# EAGLE schematic badge24_v1.1 (EAGLE 9.6.2)
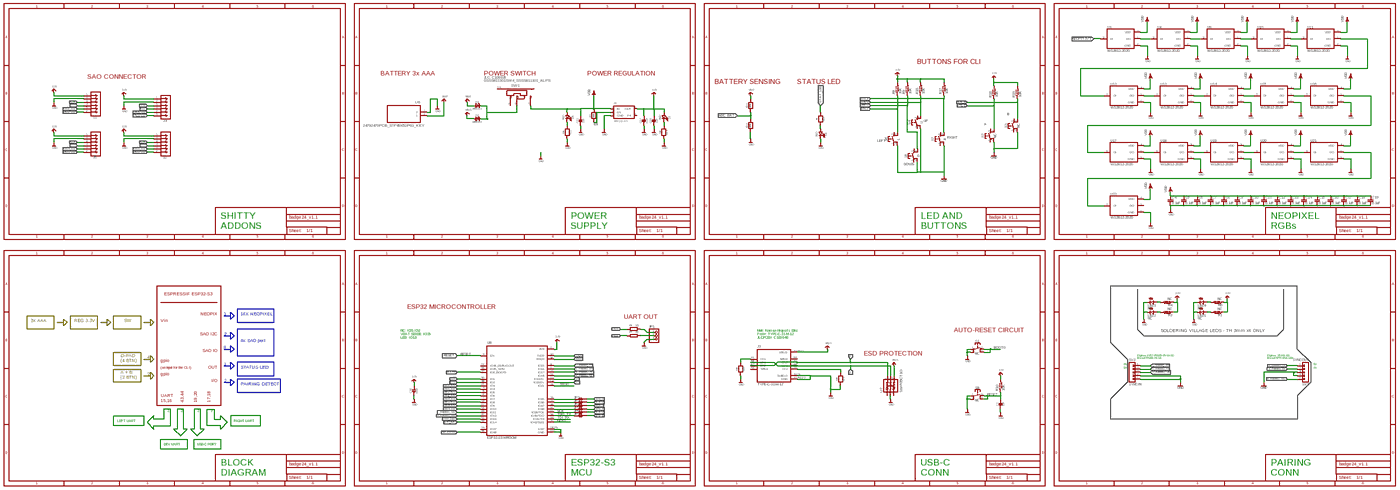
[diagram p0: schematic, sheet 1, overview]
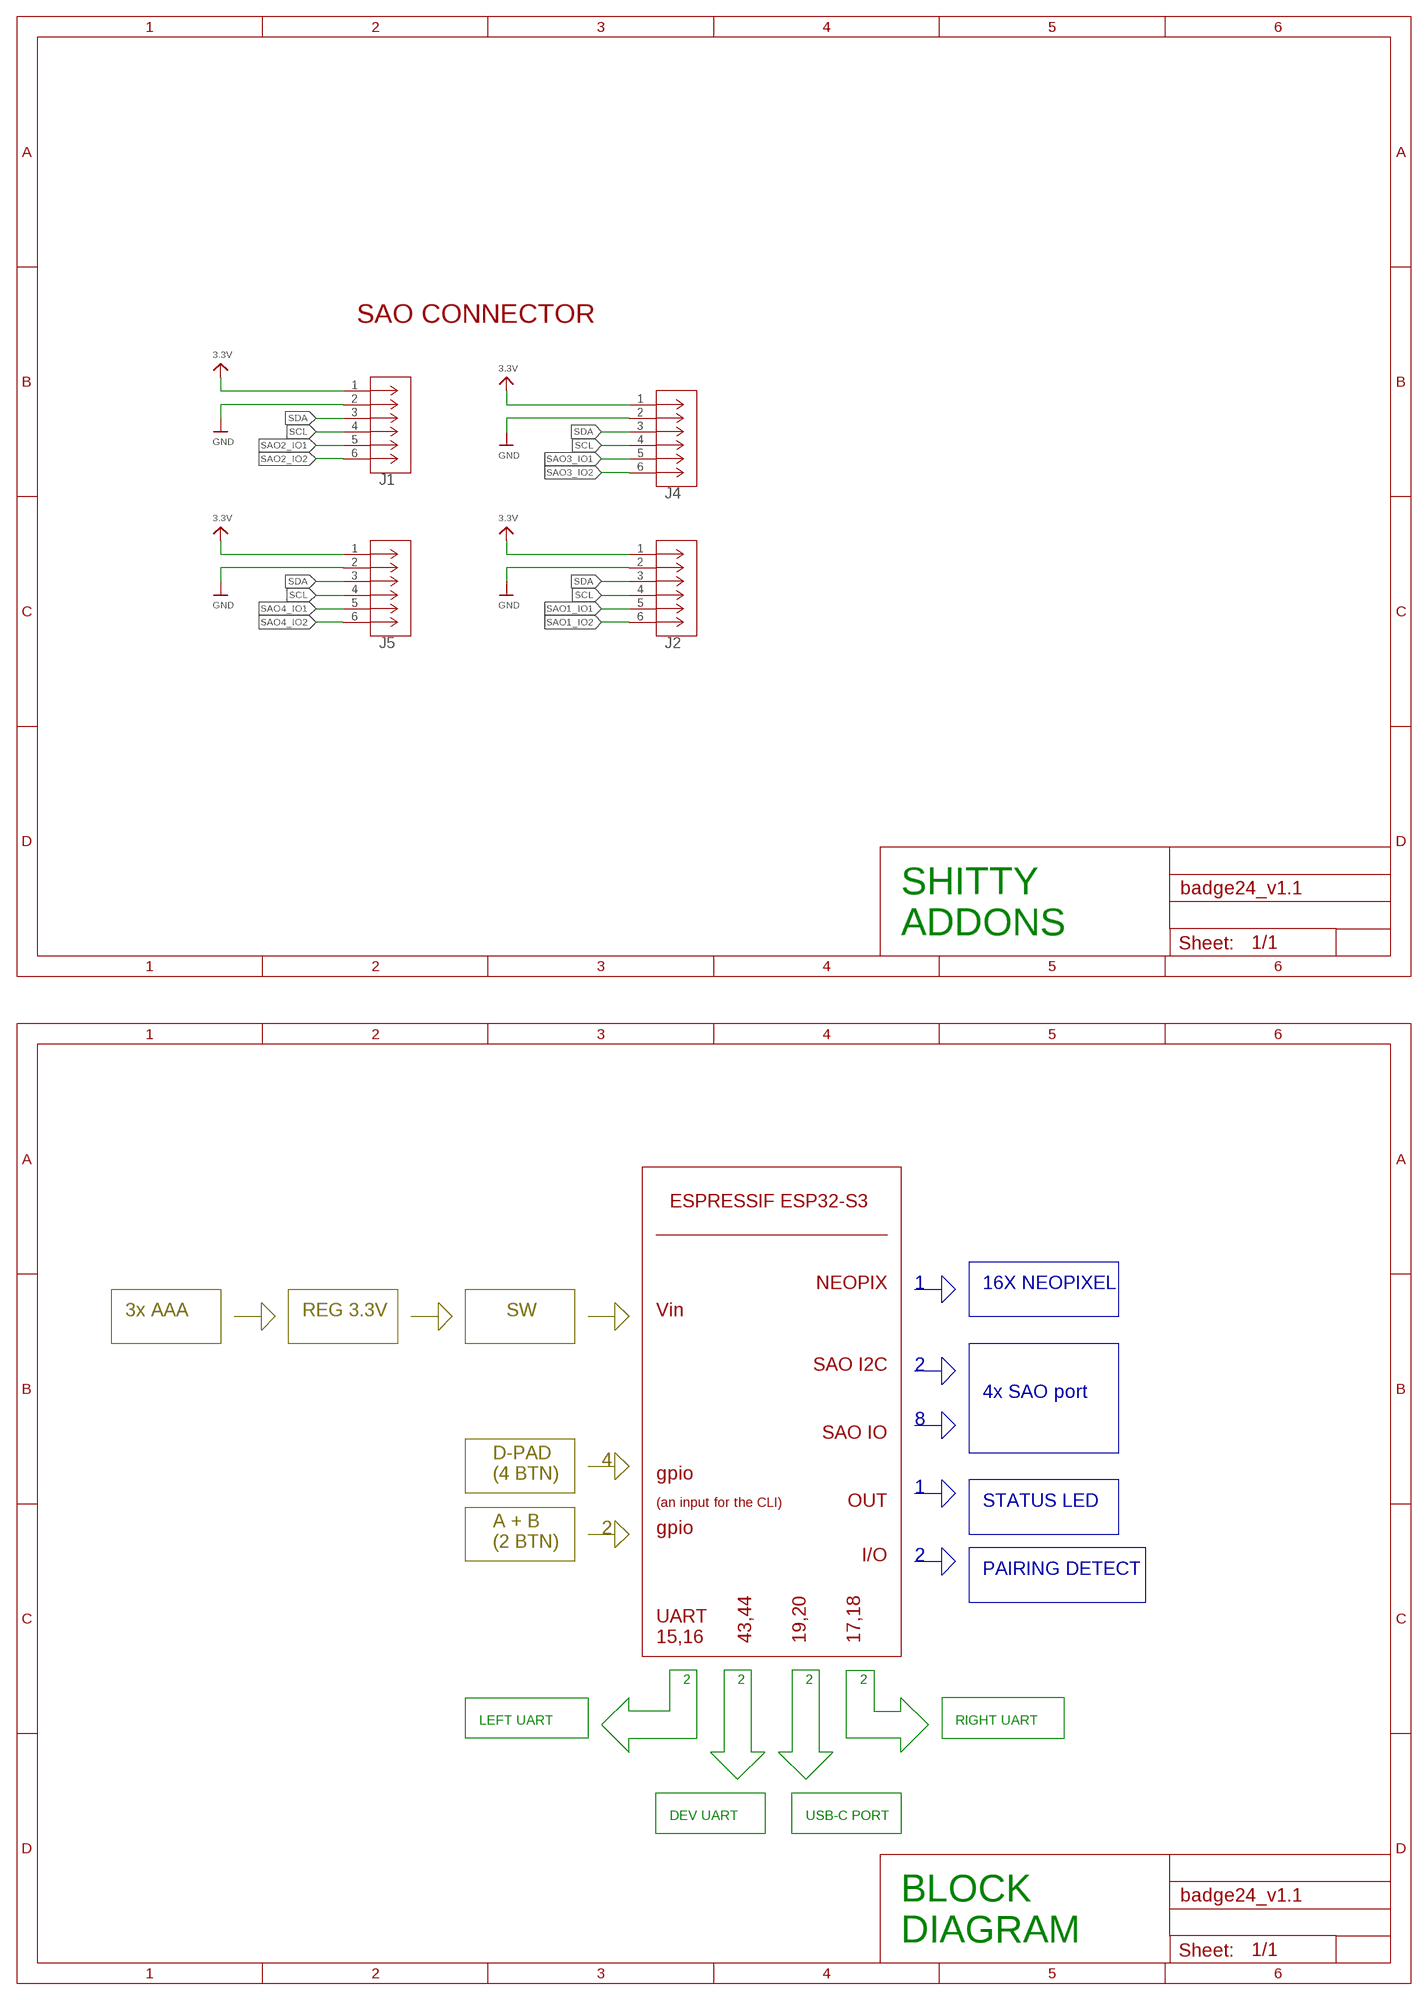
[diagram p1: schematic, sheet 1, part 1 of 4]
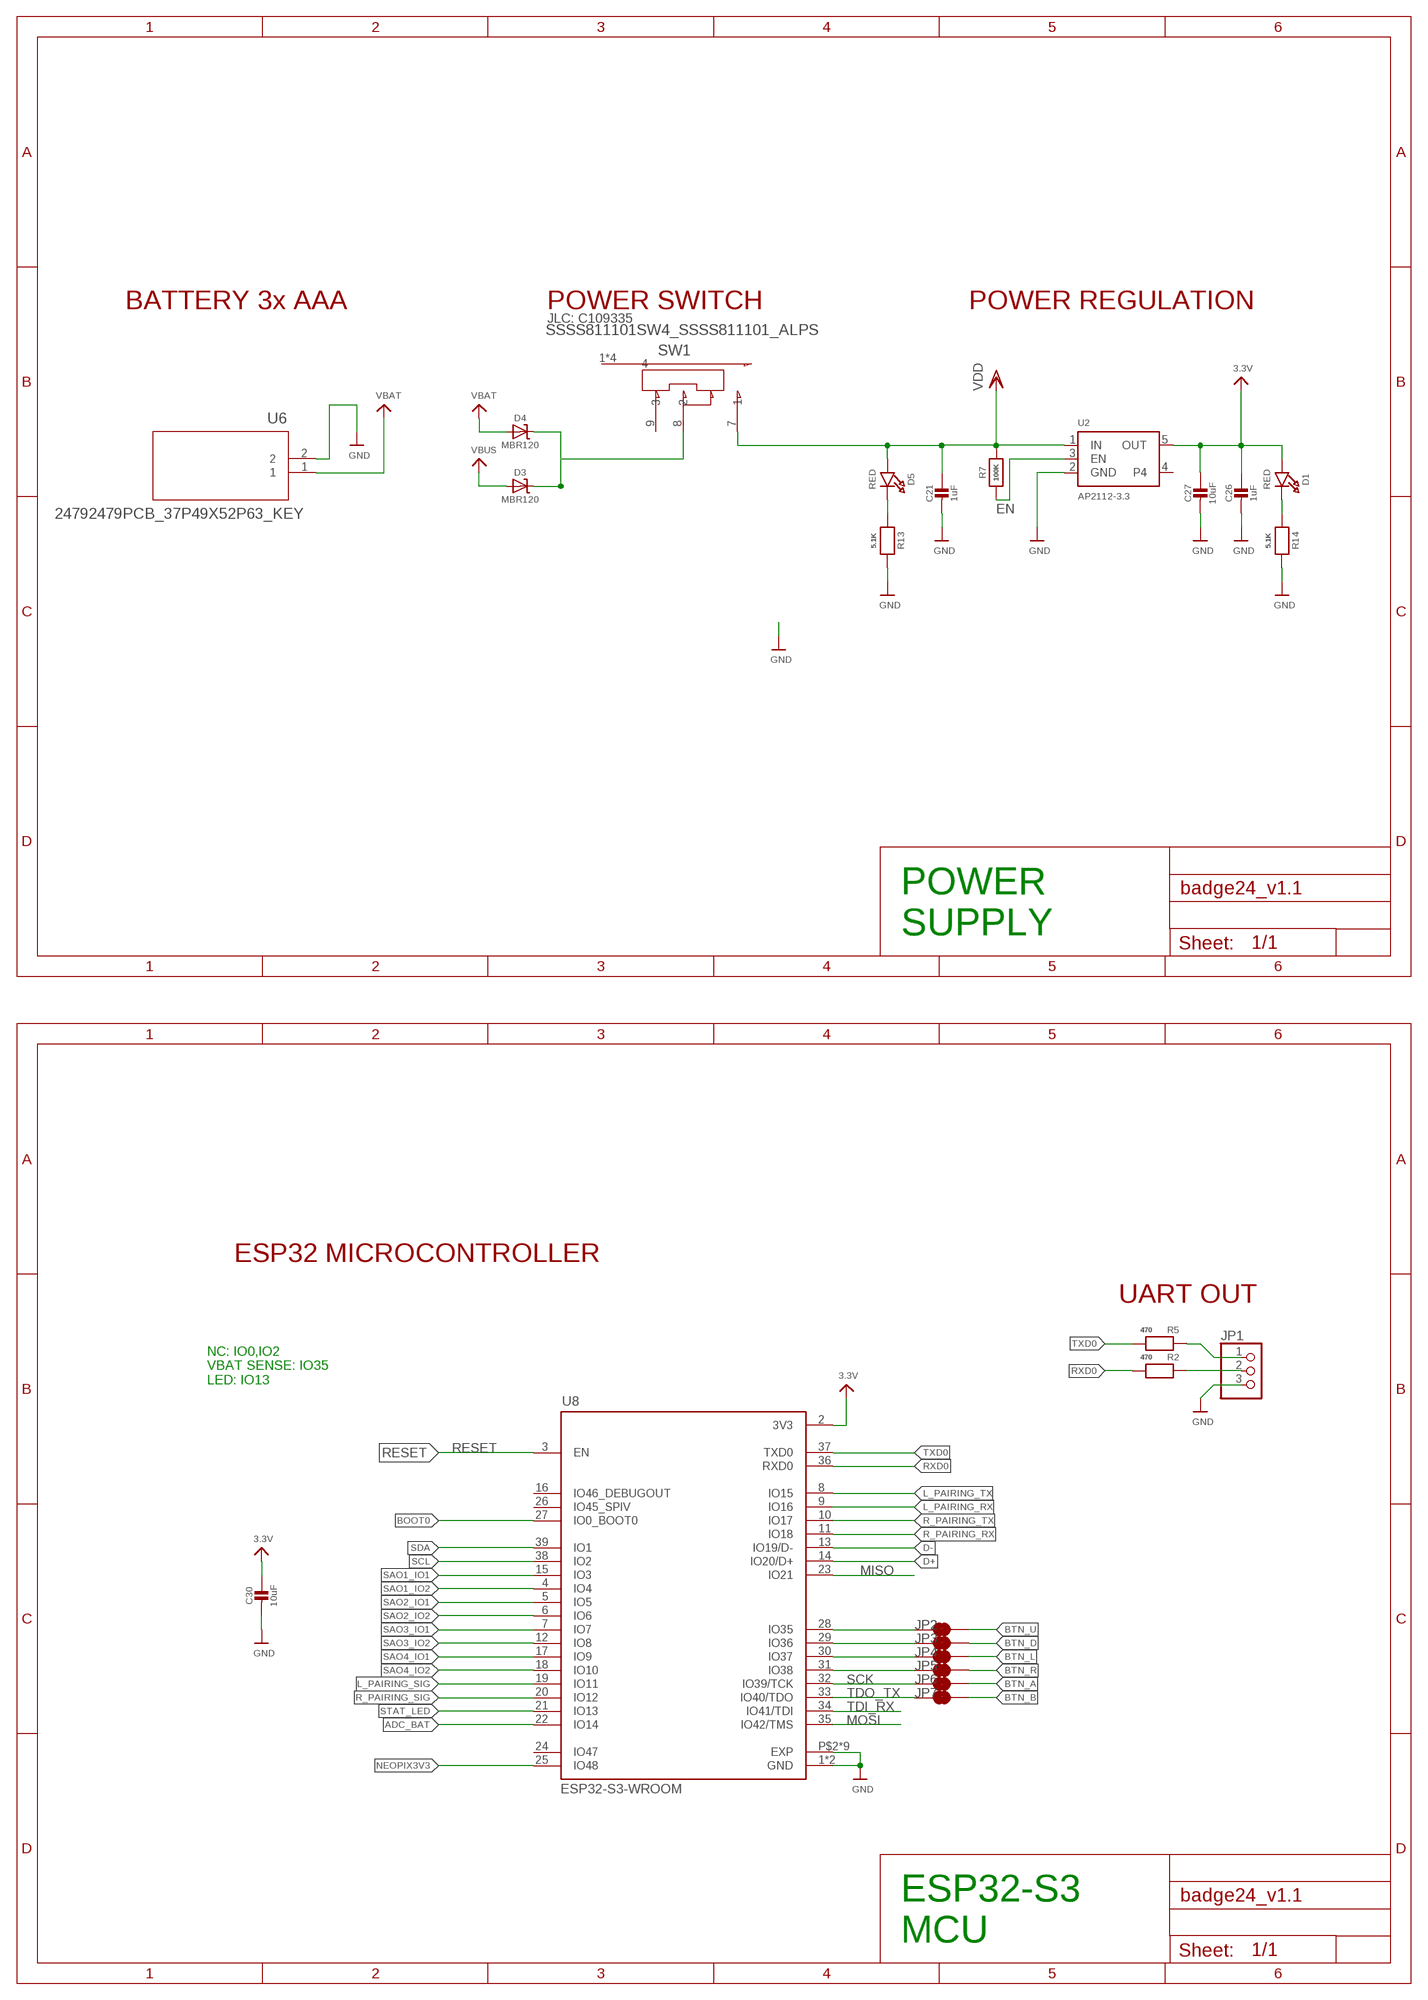
[diagram p2: schematic, sheet 1, part 2 of 4]
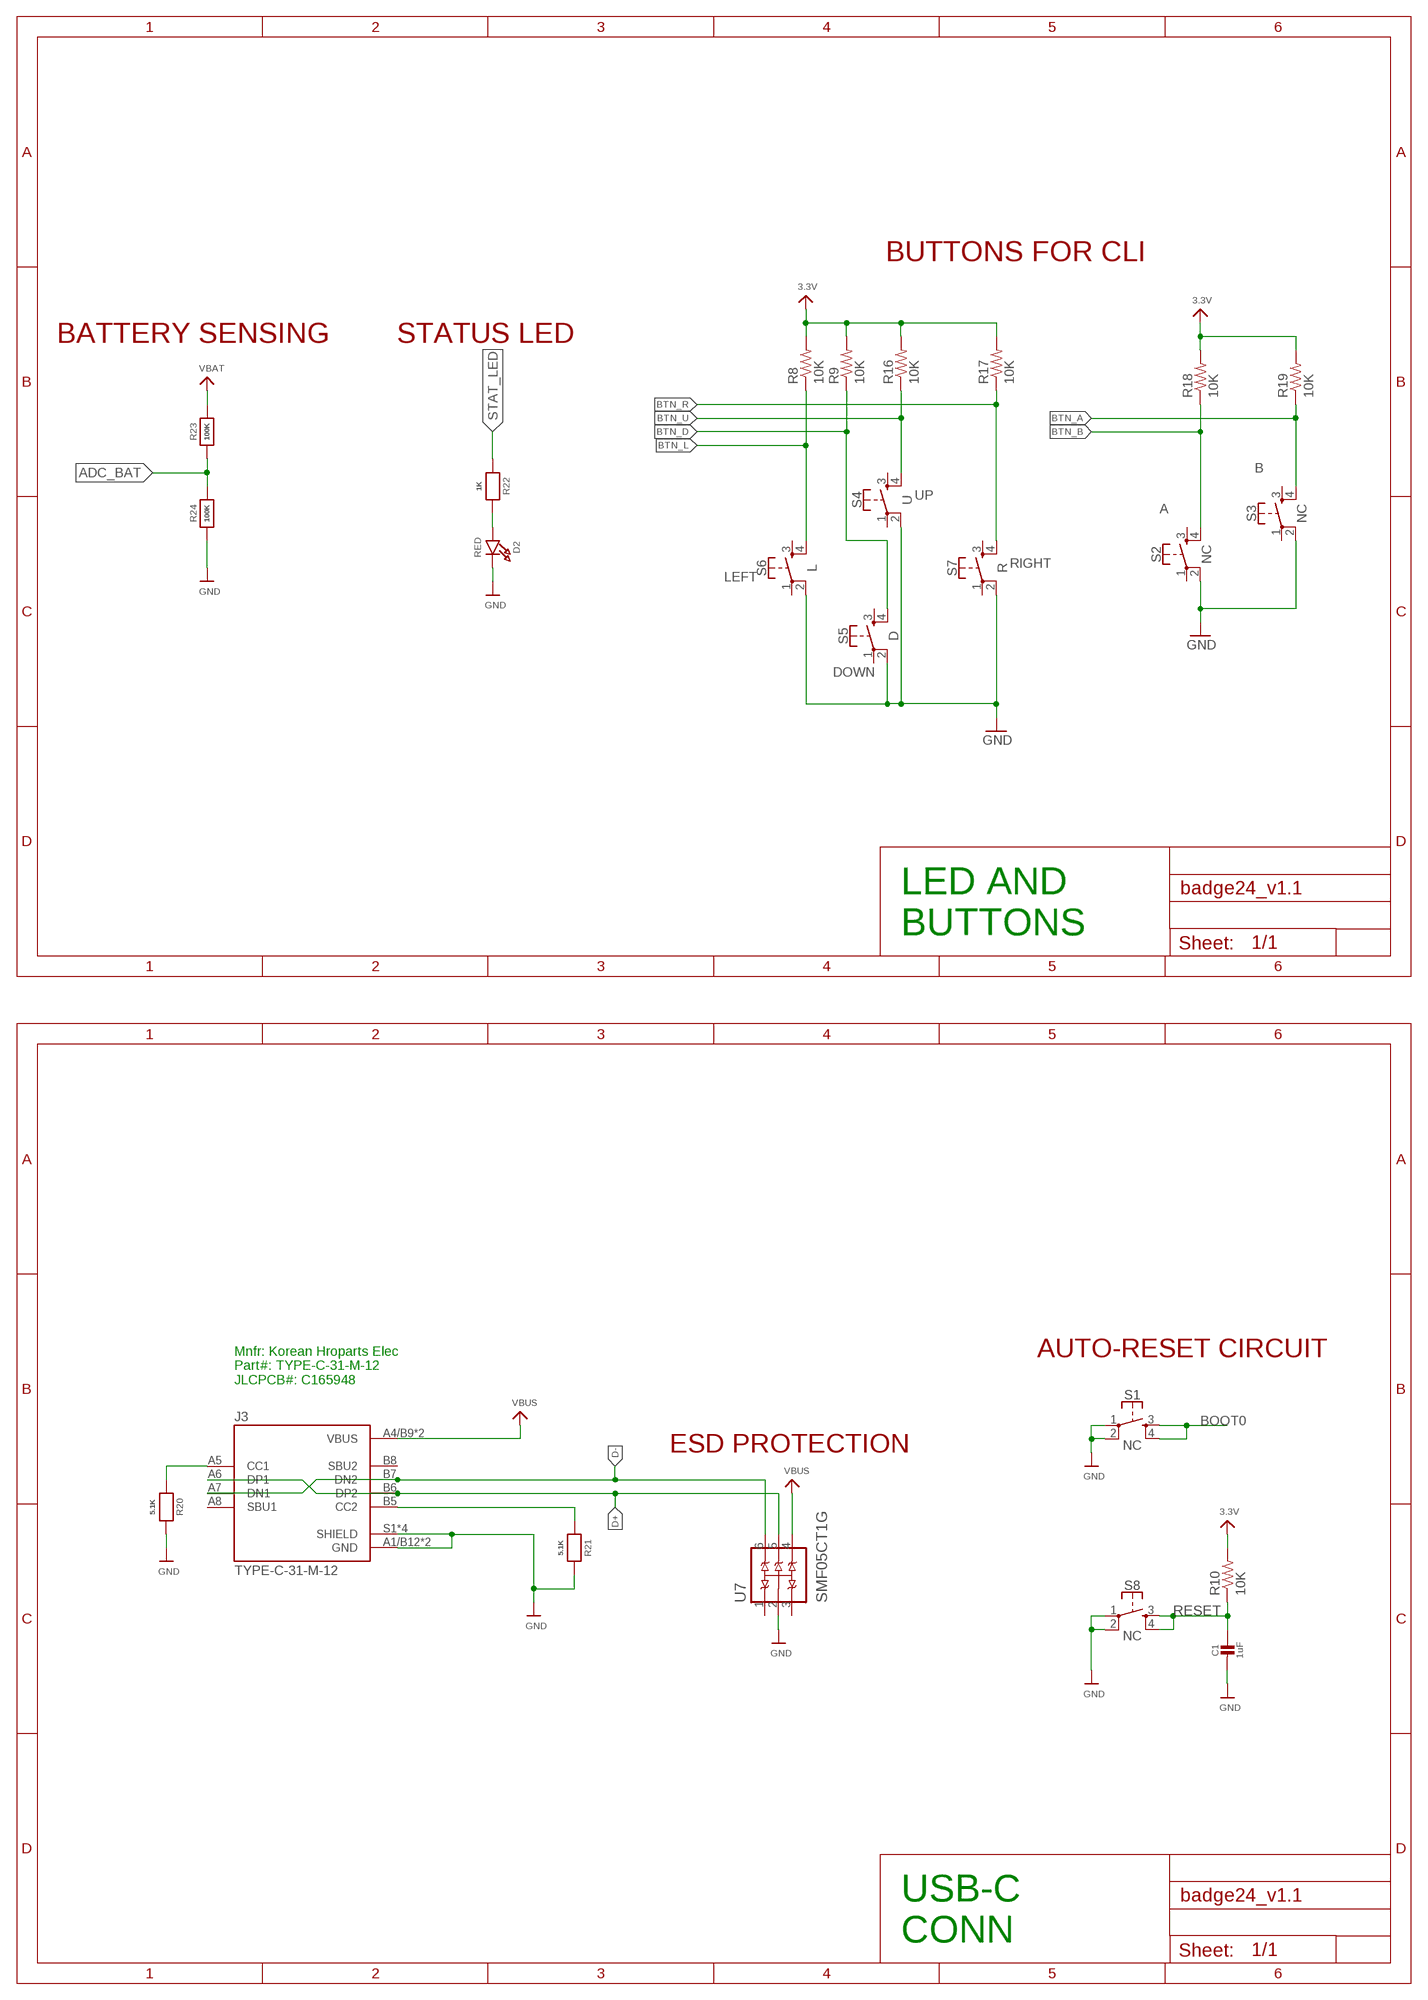
[diagram p3: schematic, sheet 1, part 3 of 4]
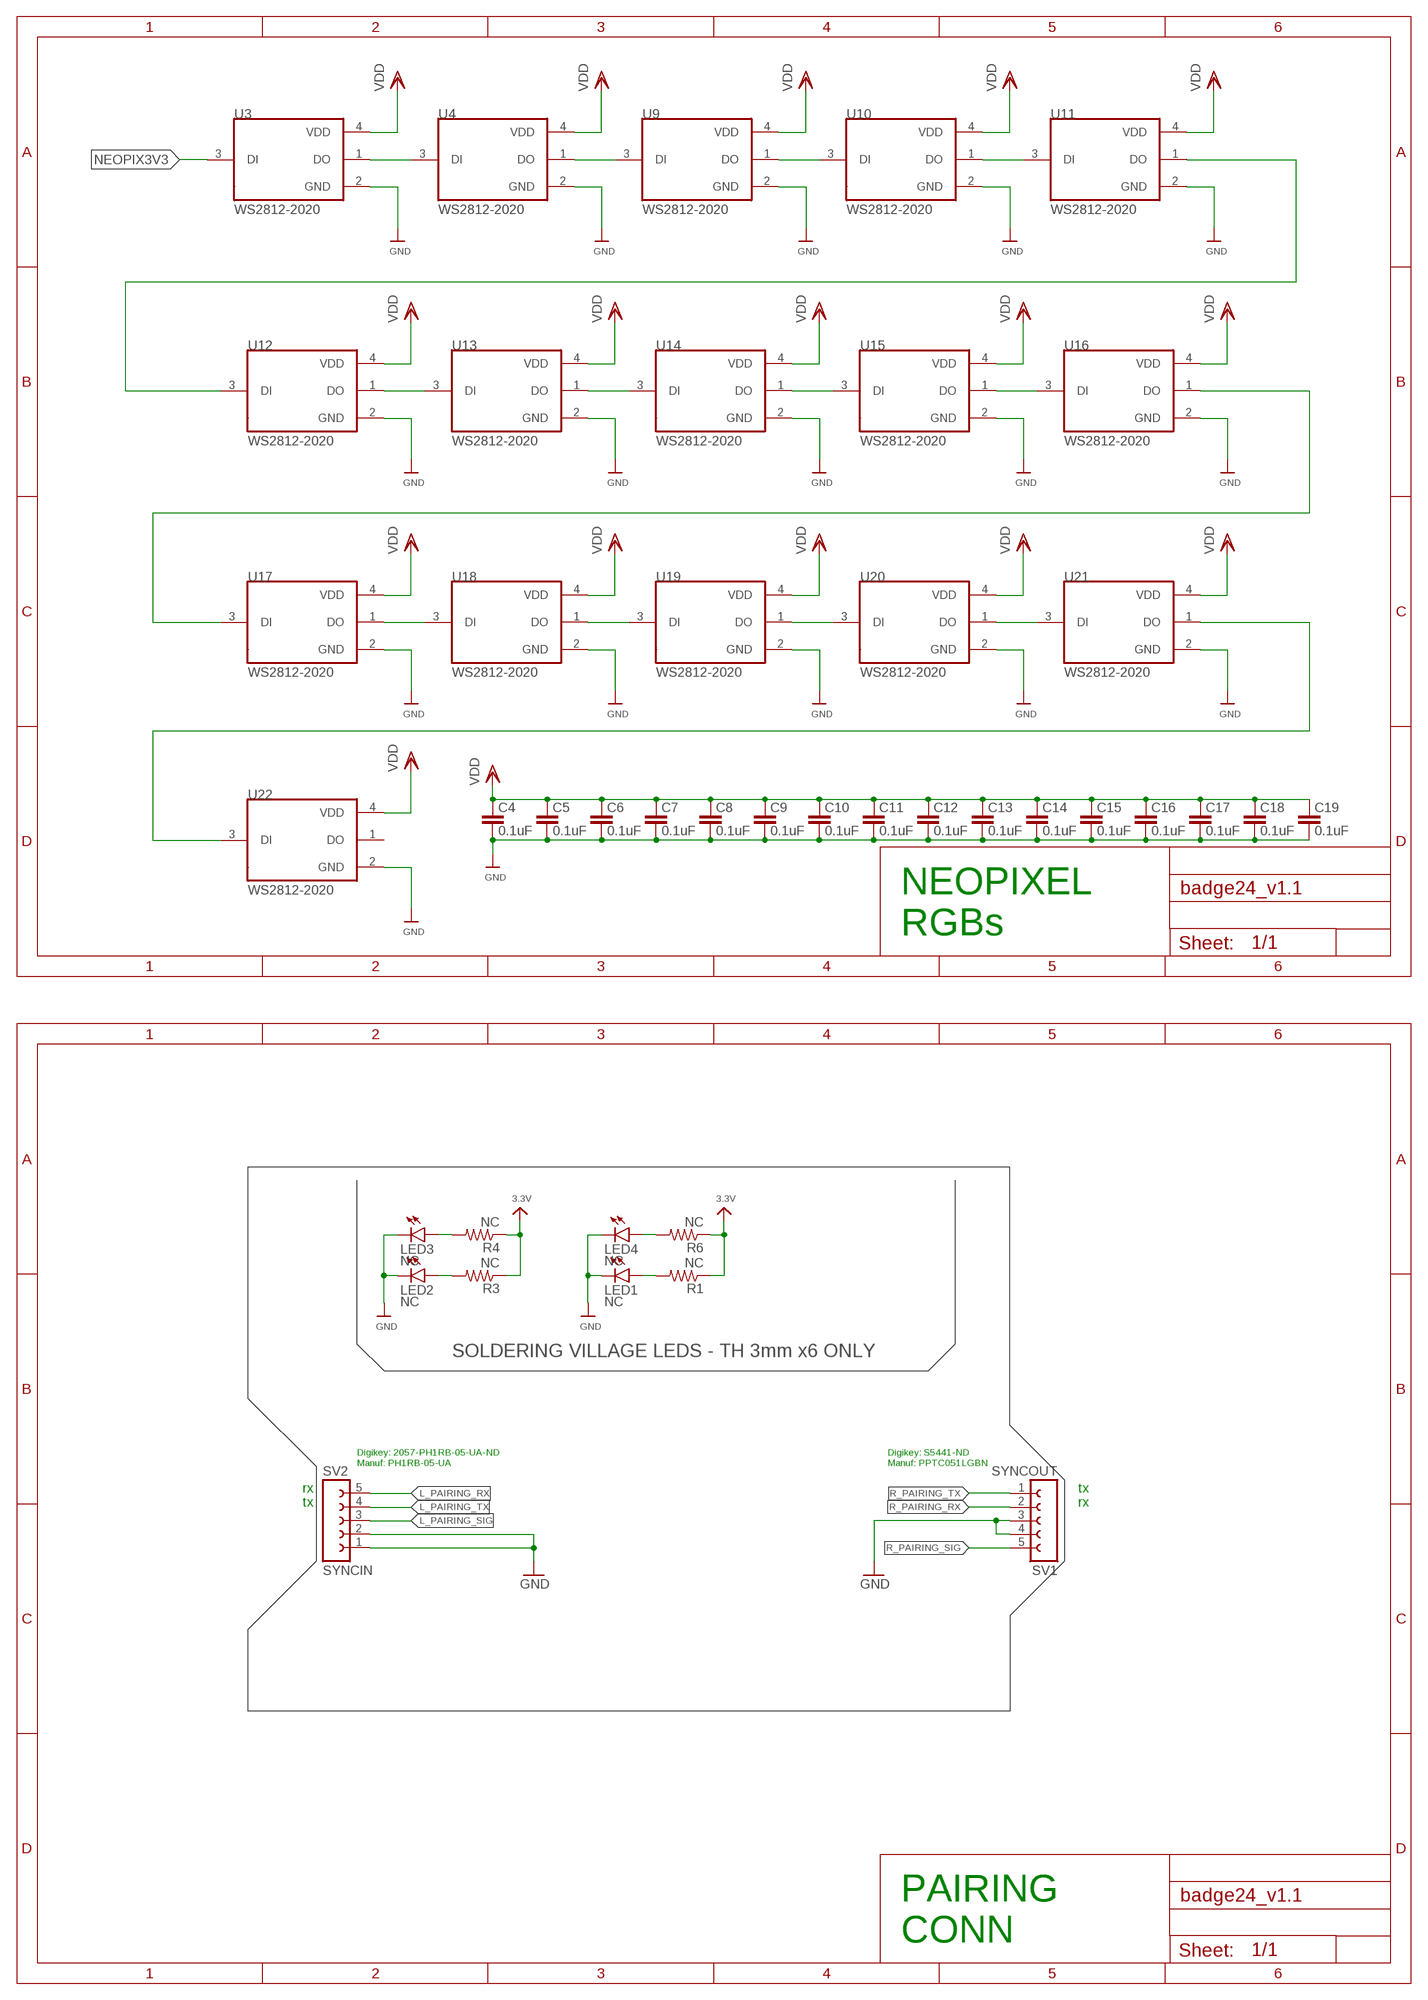
[diagram p4: schematic, sheet 1, part 4 of 4]

## Parts
C1  1uF  CAP_CERAMIC0603_NO  [0603-NO]
C4  0.1uF  CAP0603-CAP  [0603-CAP]
C5  0.1uF  CAP0603-CAP  [0603-CAP]
C6  0.1uF  CAP0603-CAP  [0603-CAP]
C7  0.1uF  CAP0603-CAP  [0603-CAP]
C8  0.1uF  CAP0603-CAP  [0603-CAP]
C9  0.1uF  CAP0603-CAP  [0603-CAP]
C10  0.1uF  CAP0603-CAP  [0603-CAP]
C11  0.1uF  CAP0603-CAP  [0603-CAP]
C12  0.1uF  CAP0603-CAP  [0603-CAP]
C13  0.1uF  CAP0603-CAP  [0603-CAP]
C14  0.1uF  CAP0603-CAP  [0603-CAP]
C15  0.1uF  CAP0603-CAP  [0603-CAP]
C16  0.1uF  CAP0603-CAP  [0603-CAP]
C17  0.1uF  CAP0603-CAP  [0603-CAP]
C18  0.1uF  CAP0603-CAP  [0603-CAP]
C19  0.1uF  CAP0603-CAP  [0603-CAP]
C21  1uF  CAP_CERAMIC0603_NO  [0603-NO]
C26  1uF  CAP_CERAMIC0603_NO  [0603-NO]
C27  10uF  CAP_CERAMIC0805-NOOUTLINE  [0805-NO]
C30  10uF  CAP_CERAMIC0805-NOOUTLINE  [0805-NO]
D1  RED  LED0805_NOOUTLINE  [CHIPLED_0805_NOOUTLINE]
D2  RED  LED0805_NOOUTLINE  [CHIPLED_0805_NOOUTLINE]
D3  MBR120  DIODE-SCHOTTKYSOD-123  [SOD-123]
D4  MBR120  DIODE-SCHOTTKYSOD-123  [SOD-123]
D5  RED  LED0805_NOOUTLINE  [CHIPLED_0805_NOOUTLINE]
J1  SSW-103-22-F-D-VS-K-TRCON3_SSW-D-DUMZ_HDR_SAI  [CON3_SSW-D-DUMZ_HDR_SAI]
J2  SSW-103-22-F-D-VS-K-TRCON3_SSW-D-DUMZ_HDR_SAI  [CON3_SSW-D-DUMZ_HDR_SAI]
J3  TYPE-C-31-M-12  [HRO_TYPE-C-31-M-12]
J4  SSW-103-22-F-D-VS-K-TRCON3_SSW-D-DUMZ_HDR_SAI  [CON3_SSW-D-DUMZ_HDR_SAI]
J5  SSW-103-22-F-D-VS-K-TRCON3_SSW-D-DUMZ_HDR_SAI  [CON3_SSW-D-DUMZ_HDR_SAI]
JP1  PINHD-1X3  [1X03]
JP2  JUMPER-SMT_2_NC_TRACE_SILK  [SMT-JUMPER_2_NC_TRACE_SILK]
JP3  JUMPER-SMT_2_NC_TRACE_SILK  [SMT-JUMPER_2_NC_TRACE_SILK]
JP4  JUMPER-SMT_2_NC_TRACE_SILK  [SMT-JUMPER_2_NC_TRACE_SILK]
JP5  JUMPER-SMT_2_NC_TRACE_SILK  [SMT-JUMPER_2_NC_TRACE_SILK]
JP6  JUMPER-SMT_2_NC_TRACE_SILK  [SMT-JUMPER_2_NC_TRACE_SILK]
JP7  JUMPER-SMT_2_NC_TRACE_SILK  [SMT-JUMPER_2_NC_TRACE_SILK]
LED1  NC  LED3MM  [LED3MM]
LED2  NC  LED3MM  [LED3MM]
LED3  NC  LED3MM  [LED3MM]
LED4  NC  LED3MM  [LED3MM]
R1  NC  R-US_0207/10  [0207/10]
R2  470  RESISTOR_0603_NOOUT  [0603-NO]
R3  NC  R-US_0207/10  [0207/10]
R4  NC  R-US_0207/10  [0207/10]
R5  470  RESISTOR_0603_NOOUT  [0603-NO]
R6  NC  R-US_0207/10  [0207/10]
R7  100K  RESISTOR_0603_NOOUT  [0603-NO]
R8  10K  RESISTOR0603-RES  [0603-RES]
R9  10K  RESISTOR0603-RES  [0603-RES]
R10  10K  RESISTOR0603-RES  [0603-RES]
R13  5.1K  RESISTOR_0603_NOOUT  [0603-NO]
R14  5.1K  RESISTOR_0603_NOOUT  [0603-NO]
R16  10K  RESISTOR0603-RES  [0603-RES]
R17  10K  RESISTOR0603-RES  [0603-RES]
R18  10K  RESISTOR0603-RES  [0603-RES]
R19  10K  RESISTOR0603-RES  [0603-RES]
R20  5.1K  RESISTOR_0603_NOOUT  [0603-NO]
R21  5.1K  RESISTOR_0603_NOOUT  [0603-NO]
R22  1K  RESISTOR_0603_NOOUT  [0603-NO]
R23  100K  RESISTOR_0603_NOOUT  [0603-NO]
R24  100K  RESISTOR_0603_NOOUT  [0603-NO]
S1  NC  MOMENTARY-SWITCH-SPST-2-SMD-5.2MM  [TACTILE_SWITCH_SMD_5.2MM]
S2  NC  MOMENTARY-SWITCH-SPST-2-SMD-5.2MM  [TACTILE_SWITCH_SMD_5.2MM]
S3  NC  MOMENTARY-SWITCH-SPST-2-SMD-5.2MM  [TACTILE_SWITCH_SMD_5.2MM]
S4  U  MOMENTARY-SWITCH-SPST-2-SMD-5.2MM  [TACTILE_SWITCH_SMD_5.2MM]
S5  D  MOMENTARY-SWITCH-SPST-2-SMD-5.2MM  [TACTILE_SWITCH_SMD_5.2MM]
S6  L  MOMENTARY-SWITCH-SPST-2-SMD-5.2MM  [TACTILE_SWITCH_SMD_5.2MM]
S7  R  MOMENTARY-SWITCH-SPST-2-SMD-5.2MM  [TACTILE_SWITCH_SMD_5.2MM]
S8  NC  MOMENTARY-SWITCH-SPST-2-SMD-5.2MM  [TACTILE_SWITCH_SMD_5.2MM]
SV1  SYNCOUT  FE05W  [FE05W]
SV2  SYNCIN  FE05W  [FE05W]
SW1  SSSS811101SW4_SSSS811101_ALPS  [SW4_SSSS811101_ALPS]
U2  AP2112-3.3  VREG_SOT23-5  [SOT23-5]
U3  WS2812-2020  [LED_WS2812-2020]
U4  WS2812-2020  [LED_WS2812-2020]
U6  24792479PCB_37P49X52P63_KEY  [2479PCB_37P49X52P63_KEY]
U7  SMF05CT1G  [SOT65P210X110-6N]
U8  ESP32-S3-WROOM  [S3-WROOM32]
U9  WS2812-2020  [LED_WS2812-2020]
U10  WS2812-2020  [LED_WS2812-2020]
U11  WS2812-2020  [LED_WS2812-2020]
U12  WS2812-2020  [LED_WS2812-2020]
U13  WS2812-2020  [LED_WS2812-2020]
U14  WS2812-2020  [LED_WS2812-2020]
U15  WS2812-2020  [LED_WS2812-2020]
U16  WS2812-2020  [LED_WS2812-2020]
U17  WS2812-2020  [LED_WS2812-2020]
U18  WS2812-2020  [LED_WS2812-2020]
U19  WS2812-2020  [LED_WS2812-2020]
U20  WS2812-2020  [LED_WS2812-2020]
U21  WS2812-2020  [LED_WS2812-2020]
U22  WS2812-2020  [LED_WS2812-2020]

## Nets
3.3V: C26.1 C27.1 C30.1 D1.A J1.1 J2.1 J4.1 J5.1 R1.1 R3.1 R4.1 R6.1 R8.2 R9.2 R10.2 R16.2 R17.2 R18.2 R19.2 U2.5(OUT) U8.2(3V3)
ADC_BAT: R23.1 R24.2 U8.22(IO14)
BOOT0: S1.3 S1.4 U8.27(IO0_BOOT0)
BTN_A: JP6.2 R19.1 S3.4
BTN_B: JP7.2 R18.1 S2.4
BTN_D: JP3.2 R9.1 S5.4
BTN_L: JP4.2 R8.1 S6.4
BTN_R: JP5.2 R17.1 S7.4
BTN_U: JP2.2 R16.1 S4.4
D+: J3.A6(DP1) J3.B6(DP2) U7.5(C4) U8.14(IO20/D+)
D-: J3.A7(DN1) J3.B7(DN2) U7.6(C5) U8.13(IO19/D-)
EN: R7.1 U2.3(EN)
GND [vcc]: C1.2 C4.1 C5.1 C6.1 C7.1 C8.1 C9.1 C10.1 C11.1 C12.1 C13.1 C14.1 C15.1 C16.1 C17.1 C18.1 C19.1 C21.2 C26.2 C27.2 C30.2 D2.C J1.2 J2.2 J3.A1/B12(GND) J3.B1/A12(GND) J3.S1(SHIELD) J3.S2(SHIELD) J3.S3(SHIELD) J3.S4(SHIELD) J4.2 J5.2 JP1.3 LED1.K(C) LED2.K(C) LED3.K(C) LED4.K(C) R13.2 R14.2 R20.2 R21.2 R24.1 S1.1 S1.2 S2.2 S3.2 S4.2 S5.2 S6.2 S7.2 S8.1 S8.2 SV1.3 SV1.4 SV2.1 SV2.2 U2.2(GND) U3.2(GND) U4.2(GND) U6.2 U7.2(A) U8.1(GND) U8.40(GND) U8.P$2(EXP) U8.P$3(EXP) U8.P$4(EXP) U8.P$5(EXP) U8.P$6(EXP) U8.P$7(EXP) U8.P$8(EXP) U8.P$9(EXP) U8.P$10(EXP) U9.2(GND) U10.2(GND) U11.2(GND) U12.2(GND) U13.2(GND) U14.2(GND) U15.2(GND) U16.2(GND) U17.2(GND) U18.2(GND) U19.2(GND) U20.2(GND) U21.2(GND) U22.2(GND)
L_PAIRING_RX: SV2.5 U8.9(IO16)
L_PAIRING_SIG: SV2.3 U8.19(IO11)
L_PAIRING_TX: SV2.4 U8.8(IO15)
MISO: U8.23(IO21)
MOSI: U8.35(IO42/TMS)
N$1: JP1.2 R2.2
N$2: J3.B5(CC2) R21.1
N$3: U4.1(DO) U9.3(DI)
N$4: U9.1(DO) U10.3(DI)
N$5: U3.1(DO) U4.3(DI)
N$6: U10.1(DO) U11.3(DI)
N$7: J3.A5(CC1) R20.1
N$8: U11.1(DO) U12.3(DI)
N$9: U12.1(DO) U13.3(DI)
N$10: U13.1(DO) U14.3(DI)
N$11: U14.1(DO) U15.3(DI)
N$12: U15.1(DO) U16.3(DI)
N$13: U16.1(DO) U17.3(DI)
N$14: U17.1(DO) U18.3(DI)
N$15: U18.1(DO) U19.3(DI)
N$16: U19.1(DO) U20.3(DI)
N$17: U20.1(DO) U21.3(DI)
N$18: LED1.A R1.2
N$19: LED2.A R3.2
N$20: U21.1(DO) U22.3(DI)
N$21: LED3.A R4.2
N$22: LED4.A R6.2
N$25: JP5.1 U8.31(IO38)
N$26: JP4.1 U8.30(IO37)
N$28: JP1.1 R5.2
N$31: JP3.1 U8.29(IO36)
N$32: JP2.1 U8.28(IO35)
N$33: D2.A R22.2
N$34: D3.C D4.C SW1.8
N$35: D5.C R13.1
N$36: D1.C R14.1
NEOPIX3V3: U3.3(DI) U8.25(IO48)
R_PAIRING_RX: SV1.2 U8.11(IO18)
R_PAIRING_SIG: SV1.5 U8.20(IO12)
R_PAIRING_TX: SV1.1 U8.10(IO17)
RESET: C1.1 R10.1 S8.3 S8.4 U8.3(EN)
RXD0: R2.1 U8.36(RXD0)
SAO1_IO1: J2.5 U8.15(IO3)
SAO1_IO2: J2.6 U8.4(IO4)
SAO2_IO1: J1.5 U8.5(IO5)
SAO2_IO2: J1.6 U8.6(IO6)
SAO3_IO1: J4.5 U8.7(IO7)
SAO3_IO2: J4.6 U8.12(IO8)
SAO4_IO1: J5.5 U8.17(IO9)
SAO4_IO2: J5.6 U8.18(IO10)
SCK: JP6.1 U8.32(IO39/TCK)
SCL: J1.4 J2.4 J4.4 J5.4 U8.38(IO2)
SDA: J1.3 J2.3 J4.3 J5.3 U8.39(IO1)
STAT_LED: R22.1 U8.21(IO13)
TDI_RX: U8.34(IO41/TDI)
TDO_TX: JP7.1 U8.33(IO40/TDO)
TXD0: R5.1 U8.37(TXD0)
VBAT: D4.A R23.2 U6.1
VBUS: D3.A J3.A4/B9(VBUS) J3.B4/A9(VBUS) U7.4(C3)
VDD: C4.2 C5.2 C6.2 C7.2 C8.2 C9.2 C10.2 C11.2 C12.2 C13.2 C14.2 C15.2 C16.2 C17.2 C18.2 C19.2 C21.1 D5.A R7.2 SW1.7 U2.1(IN) U3.4(VDD) U4.4(VDD) U9.4(VDD) U10.4(VDD) U11.4(VDD) U12.4(VDD) U13.4(VDD) U14.4(VDD) U15.4(VDD) U16.4(VDD) U17.4(VDD) U18.4(VDD) U19.4(VDD) U20.4(VDD) U21.4(VDD) U22.4(VDD)
Unconnected: J3.A8(SBU1) J3.B8(SBU2) S2.1 S2.3 S3.1 S3.3 S4.1 S4.3 S5.1 S5.3 S6.1 S6.3 S7.1 S7.3 SW1.1 SW1.2 SW1.3 SW1.4 SW1.9 U2.4 U7.1(C1) U7.3(C2) U8.16(IO46_DEBUGOUT) U8.24(IO47) U8.26(IO45_SPIV) U22.1(DO)

## Buses
B$6
B$8

## Notes on the sheet
- BUTTONS FOR CLI
- BATTERY 3x AAA | POWER SWITCH | POWER REGULATION
- SAO CONNECTOR | JLC: C109335 | BATTERY SENSING | STATUS LED
- B
- UP
- A
- RIGHT
- LEFT
- DOWN
- SHITTY
  ADDONS
- POWER
  SUPPLY
- LED AND
  BUTTONS
- NEOPIXEL
  RGBs
- ESPRESSIF ESP32-S3
- ESP32 MICROCONTROLLER
- NEOPIX
- 1 | 16X NEOPIXEL
- UART OUT
- 3x AAA | REG 3.3V | SW | Vin
- SAO I2C | AUTO-RESET CIRCUIT | SOLDERING VILLAGE LEDS - TH 3mm x6 ONLY
- 2
- NC: IO0,IO2
  VBAT SENSE: IO35
  LED: IO13
- Mnfr: Korean Hroparts Elec
  Part#: TYPE-C-31-M-12
  JLCPCB#: C165948
- 4x SAO port
- SAO IO | 8
- ESD PROTECTION
- 4
- Digikey: 2057-PH1RB-05-UA-ND
  Manuf: PH1RB-05-UA
- Digikey: S5441-ND
  Manuf: PPTC051LGBN
- D-PAD 
  (4 BTN)
- gpio
- OUT | 1
- (an input for the CLI) | STATUS LED
- rx
  tx
- tx
  rx
- 2 | gpio
- A + B
  (2 BTN)
- I/O
- 2
- PAIRING DETECT
- UART
  15,16
- 43,44 | 19,20 | 17,18
- 2 | 2 | 2 | 2
- LEFT UART | RIGHT UART
- DEV UART | USB-C PORT
- BLOCK 
  DIAGRAM
- ESP32-S3
  MCU
- USB-C
  CONN
- PAIRING
  CONN

## Library data of the parts
C1 C21 C26 C27 C30 = microbuilder:CAP_CERAMIC: Ceramic Capacitors For new designs, use the packages preceded by an '_' character since they are more reliable: The following footprints should be used on most boards: _0402 - Standard footprint for regular board layouts _0603 - Standard footprint for regular board layouts _0805 - Standard footprint for regular board layouts _1206 - Standard footprint for regular board layouts For extremely tight-pitch boards where space is at a premium, the following 'micro-pitch' footprints can be used (smaller pads, no silkscreen outline, etc.): _0402MP - Micro-pitch footprint for very dense/compact boards _0603MP - Micro-pitch footprint for very dense/compact boards _0805MP - Micro-pitch footprint for very dense/compact boards _1206MP - Micro-pitch footprint for very dense/compact boards
C4-C19 = SparkFun:CAP: Capacitor Standard 0603 ceramic capacitor, and 0.1" leaded capacitor.
D1 D2 D5 = microbuilder:LED: LED
D3 D4 = microbuilder:DIODE-SCHOTTKY
J1 J2 J4 J5 = SSW-103-22-F-D-VS-K-TR:SSW-103-22-F-D-VS-K-TR; COPYRIGHT: Copyright (C) 2022 Ultra Librarian. All rights reserved.; DIGI-KEY_PART_NUMBER_1: SAM14622CT-ND; DIGI-KEY_PART_NUMBER_2: SAM14622DKR-ND; DIGI-KEY_PART_NUMBER_3: SAM14622TR-ND; MANUFACTURER_PART_NUMBER: SSW-103-22-F-D-VS-K-TR; MFR_NAME: Samtec Inc
J3 = TYPE-C-31-M-12:TYPE-C-31-M-12; MANUFACTURER: HRO Electronics Co., Ltd.; MAXIMUM_PACKAGE_HEIGHT: 3.26 mm; PARTREV: 2020.12.08; SNAPEDA_PN: TYPE-C-31-M-12; STANDARD: Manufacturer Recommendations
JP1 = pinhead:PINHD-1X3: PIN HEADER
JP2-JP7 = SparkFun-Jumpers:JUMPER-SMT_2_NC_TRACE: Normally closed trace jumper This jumper has a trace between two pads so it's normally closed (NC). Use a razor knife to open the connection. For best results follow the IPC guidelines for cutting traces: Cutout at least 0.063 mm (0.005 in). Remove all loose material to clean up the cut area. Seal the cut with an approved epoxy. Reapply solder to reclose the connection.
LED1-LED4 = led:LED: LED
R1 R3 R4 R6 = rcl:R-US_: RESISTOR, American symbol; SPICEPREFIX: R
R2 R5 R7 R13 R14 R20-R24 = microbuilder:RESISTOR: Resistors For new designs, use the packages preceded by an '_' character since they are more reliable: The following footprints should be used on most boards: _0402 - Standard footprint for regular board layouts _0603 - Standard footprint for regular board layouts _0805 - Standard footprint for regular board layouts _1206 - Standard footprint for regular board layouts For extremely tight-pitch boards where space is at a premium, the following 'micro-pitch' footprints can be used (smaller pads, no silkscreen outline, etc.): _0402MP - Micro-pitch footprint for very dense/compact boards _0603MP - Micro-pitch footprint for very dense/compact boards _0805MP - Micro-pitch footprint for very dense/compact boards _1206MP - Micro-pitch footprint for very dense/compact boards
R8-R10 R16-R19 = SparkFun:RESISTOR: Resistor Basic schematic elements and footprints for 0603, 1206, and PTH resistors.
S1-S8 = SparkFun-Switches:MOMENTARY-SWITCH-SPST-2: Momentary Switch (Pushbutton) - SPST - Two Circuits Normally-open (NO) SPST momentary switches (buttons, pushbuttons). Schematic symbol includes two switch circuits. Variants SMD-4.6MMX2.8MM - 4.60mm x 2.80mm Tactile Momentary Button Switch - Used on SparkFun SAMD21 Mini Breakout <https://www.sparkfun.com/products/13664> SMD-5.2MM - Mini Pushbutton Switch - SMD <https://www.sparkfun.com/products/8720> - Used on Arduino Pro Mini <https://www.sparkfun.com/products/11114>; PROD_ID: SWCH-08247; SF_SKU: COM-08720
SV1 SV2 = con-lsta:FE05W: FEMALE HEADER; OC_FARNELL: unknown; OC_NEWARK: unknown
SW1 = SSSS811101:SSSS811101; COPYRIGHT: Copyright (C) 2023 Ultra Librarian. All rights reserved.; MANUFACTURER_PART_NUMBER: SSSS811101; MFR_NAME: Alps Electric
U2 = microbuilder:VREG_SOT23-5: SOT23-5 Fixed Voltage Regulators Part Current Out V Out V In V Dropout θJA (°C/W) TJ (°C) Digikey Part No. ADP121 150mA 3.3V 3.4-5.5V 0.09V @ 150mA -- -- ADP121-AUJZ33R7CT-ND ADP121 150mA 3.0V 3.1-5.5V 0.09V @ 150mA -- -- ADP121-AUJZ30R7CT-ND ADP122 300mA 3.3V 3.4-5.5V 0.085V @ 300mA -- -- ADP122AUJZ-3.3-R7CT-ND ADP1712 300mA 3.3V 3.5-5.5V 0.17V @ 300mA -- -- ADP1712AUJZ-3.3-R7TR-ND AP7311 (Low Cost) 150mA 3.3V 3.5-6V 0.15V @ 150mA -- -- AP7311-33WG-7DICT-ND LD39015M18R 150mA 1.8V 1.9V-5.5V 0.08V @ 100mA -- -- 497-6977-1-ND LP2985A-33DBVR 150mA 3.3V 3.3-16V 0.28V @ 150mA 206 150 296-18479-1-ND MCP1824T-3302E/OT 300mA 3.3V 3.5V-6V 0.2V @ 300mA -- -- MCP1824T-3302E/OTCT-ND MIC5205-2.5YM5 TR 150mA 2.5V 2.7-16V 0.165V @ 150mA -- -- 576-1257-2-ND MIC5205-3.0YM5 TR 150mA 3.0V 3.2V-16V 0.165V @ 150mA -- -- 576-1258-2-ND MIC5205-3.3YM5 TR 150mA 3.3V 3.5V-16V 0.165V @ 150mA -- -- 576-1259-2-ND TPS780330220 150mA 3.3V+2.2V 3.6-5.5V 250mV Max -- -- 296-23332-1-ND TDA3663/N1,135 100mA 3.3V 3.5-45V 0.18V @ 50mA -- -- 568-5343-1-ND Max operating temp can be calculated using θJA, TJ (max junction temperature), and power in watts. Set the "Maximum Ambient Temperature" until it reaches TJ ("Max Junction Temperature"), which is the absolute limit for safe use of the regulator: Heat Sink Temperature Calculator <http://www.daycounter.com/Calculators/Heat-Sink-Temperature-Calculator.phtml> For example, With 12V source into a 3.3V LP2985 and a 30mA load, we are dissipating (12V-3.3V) * 0.03A = 0.261W. With a θJA of 206 °C/W, a TJ of 150°C, and 261mW we can safely use the chip without a heat sink up to 75°C (=147.1°C Junction Temperature).
U3 U4 U9-U22 = WS2812-2020:WS2812-2020: Intelligent control LED integrated light source Check availability <https://pricing.snapeda.com/parts/WS2812-2020/Worldsemi/view-part?ref=eda>; AVAILABILITY: Not in stock; DESCRIPTION: Intelligent control LED light source, SMD-4; MF: Worldsemi; MP: WS2812-2020; PACKAGE: Package; PRICE: None
U6 = 36-2479-ND_AAA-3x:2479; COPYRIGHT: Copyright (C) 2022 Ultra Librarian. All rights reserved.; DIGI-KEY_PART_NUMBER_1: 1528-1350-ND; DIGI-KEY_PART_NUMBER_2: 2183-2479-ND; DIGI-KEY_PART_NUMBER_3: 2479K-ND; DIGI-KEY_PART_NUMBER_4: 36-2479-ND; DIGI-KEY_PART_NUMBER_5: 36-2479-NDL; MANUFACTURER_PART_NUMBER: 2479; MFR_NAME: Keystone Electronics
U7 = SMF05CT1G:SMF05CT1G: SMF05C Series 7.2 V 100 W 5-Line Transient Voltage Suppressor Array - SC-88 Check prices <https://pricing.snapeda.com/parts/SMF05CT1G/ON%20Semiconductor/view-part?ref=eda>; AVAILABILITY: In Stock; DESCRIPTION: 12.5V Clamp 8A (8/20µs) Ipp Tvs Diode Surface Mount SC-88/SC70-6/SOT-363; MF: ON Semiconductor; MP: SMF05CT1G; PACKAGE: SC-88-6 ON Semiconductor; PRICE: None; PURCHASE-URL: https://pricing.snapeda.com/search/part/SMF05CT1G/?ref=eda
U8 = adafruit_wireless:ESP32-S3-WROOM: WiFi 802.11b/g/n Transceiver Module 2.4GHz Antenna Not Included Surface Mount Check prices <https://snapeda.com/parts/ESP32-S2-WROVER/Espressif%20Systems/view-part/?ref=eda>

## Net classes
1 vcc: width 0.254 mm
2 lowpower: width 0.305 mm, drill 0.483 mm
3 Power: width 0.305 mm, drill 0.483 mm